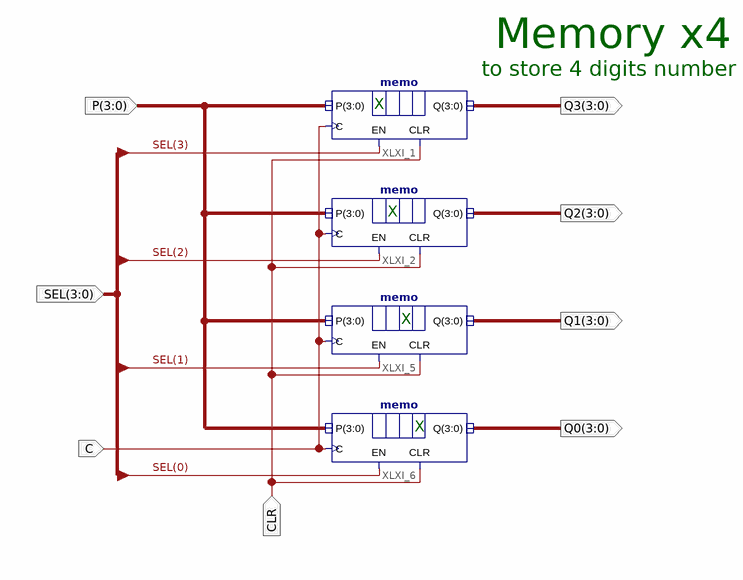
[diagram p0: schematic sheet 1]
// Xilinx ISE schematic memo4.sch (spartan6) as structural Verilog: 4 symbols, 8 ports
module memo4 (
  input  [3:0] P,
  input  C,
  input  [3:0] SEL,
  input  CLR,
  output [3:0] Q3,
  output [3:0] Q2,
  output [3:0] Q1,
  output [3:0] Q0
);

  memo XLXI_1 (.EN(SEL[3]), .Q(Q3), .P(P), .C(C), .CLR(CLR));
  memo XLXI_2 (.EN(SEL[2]), .Q(Q2), .P(P), .C(C), .CLR(CLR));
  memo XLXI_5 (.EN(SEL[1]), .Q(Q1), .P(P), .C(C), .CLR(CLR));
  memo XLXI_6 (.EN(SEL[0]), .Q(Q0), .P(P), .C(C), .CLR(CLR));

  // Notes on the sheet:
  //   Memory x4
  //   to store 4 digits number
  //   X
  //   X
  //   X
  //   X
endmodule
